# Altium schematic sheet ARDUINO_PINOUT.SchDoc
size A4
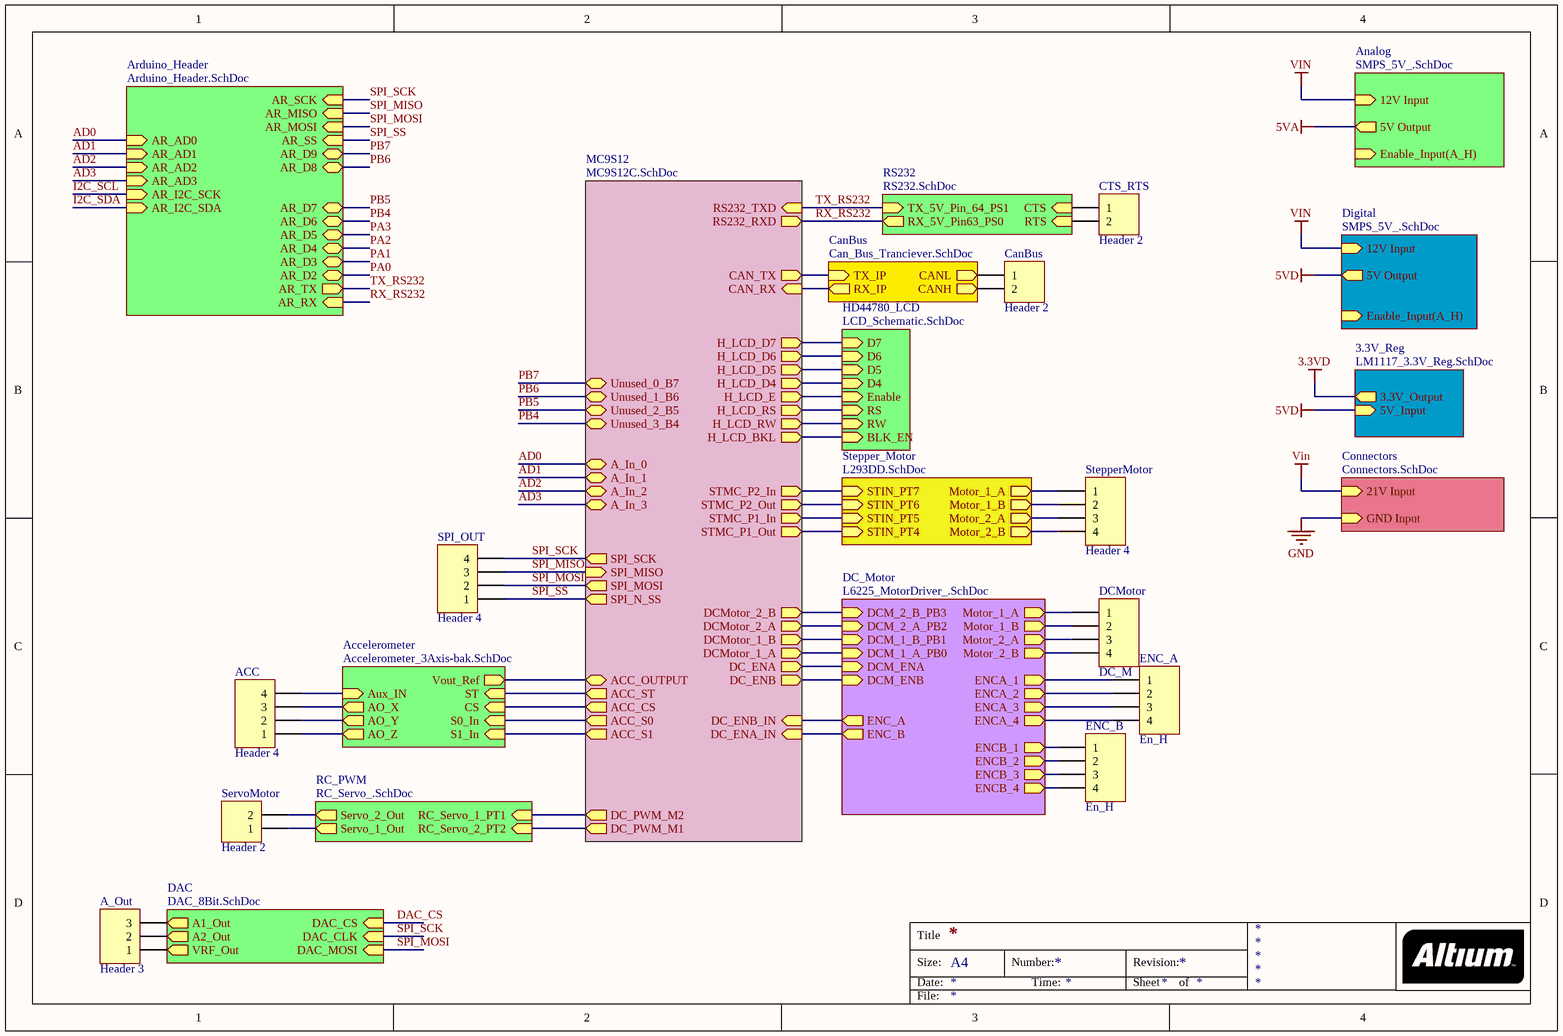
[diagram p0: ARDUINO_PINOUT.SchDoc]

## Parts
A_Out  Header 3  [HDR1X3]
ACC  Header 4  [HDR1X4]
CanBus  Header 2  [HDR1X2]
CTS_RTS  Header 2  [HDR1X2]
DCMotor  DC_M  [HDR1X4]
ENC_A  En_H  [HDR1X4]
ENC_B  En_H  [HDR1X4]
ServoMotor  Header 2  [HDR1X2]
SPI_OUT  Header 4  [HDR1X4]
StepperMotor  Header 4  [HDR1X4]

## Sub-sheets
3.3V_Reg = LM1117_3.3V_Reg.SchDoc: 3.3V_Output (out), 5V_Input (in)
Accelerometer = Accelerometer_3Axis-bak.SchDoc: AO_X (out), AO_Y (out), AO_Z (out), Aux_IN (in), S1_In (in), S0_In (in), Vout_Ref (out), ST (in), CS (in)
Analog = SMPS_5V_.SchDoc: 5V Output (out), 12V Input (in), Enable_Input(A_H) (in)
Arduino_Header = Arduino_Header.SchDoc: AR_RX (in), AR_TX (out), AR_AD0 (in), AR_AD1 (in), AR_AD2 (in), AR_AD3 (in), AR_I2C_SCK (in), AR_I2C_SDA (in), AR_D2, AR_D3, AR_D4, AR_D5, AR_D6, AR_D7, AR_D8, AR_D9, AR_MISO (in), AR_MOSI (in), AR_SCK (in), AR_SS (in)
CanBus = Can_Bus_Tranciever.SchDoc: TX_IP (in), CANH (out), CANL (out), RX_IP (out)
Connectors = Connectors.SchDoc: 21V Input (in), GND Input (in)
DAC = DAC_8Bit.SchDoc: A1_Out (out), A2_Out (out), VRF_Out (out), DAC_CS (in), DAC_CLK (in), DAC_MOSI (in)
DC_Motor = L6225_MotorDriver_.SchDoc: Motor_1_A (out), Motor_1_B (out), Motor_2_A (out), Motor_2_B (out), DCM_2_B_PB3 (in), DCM_2_A_PB2 (in), DCM_1_B_PB1 (in), DCM_1_A_PB0 (in), DCM_ENA (in), DCM_ENB (in), ENCA_1 (out), ENCA_2 (out), ENCA_3 (out), ENCA_4 (out), ENCB_1 (out), ENCB_2 (out), ENCB_3 (out), ENCB_4 (out), ENC_A (out), ENC_B (out)
Digital = SMPS_5V_.SchDoc: 5V Output (out), 12V Input (in), Enable_Input(A_H) (in)
HD44780_LCD = LCD_Schematic.SchDoc: D7 (in), D6 (in), D5 (in), D4 (in), Enable (in), RS (in), RW (in), BLK_EN (in)
MC9S12 = MC9S12C.SchDoc: RS232_TXD (in), RS232_RXD (out), H_LCD_D7 (out), H_LCD_D6 (out), H_LCD_D5 (out), H_LCD_D4 (out), H_LCD_RW (out), H_LCD_RS (out), H_LCD_E (out), CAN_TX (out), CAN_RX (in), DCMotor_2_B (out), DCMotor_2_A (out), DCMotor_1_B (out), DCMotor_1_A (out), DC_PWM_M1 (out), DC_PWM_M2 (out), STMC_P2_In (out), STMC_P2_Out (out), STMC_P1_In (out), STMC_P1_Out (out), DC_ENA (out), DC_ENB (out), H_LCD_BKL (out), SPI_SCK (out), SPI_MOSI (out), SPI_N_SS (out), SPI_MISO (in), DC_ENB_IN (in), DC_ENA_IN (in), ACC_OUTPUT (bidir), ACC_ST (out), ACC_CS (out), ACC_S0 (out), ACC_S1 (out), A_In_2 (bidir), A_In_0 (bidir), A_In_1 (bidir), A_In_3 (bidir), Unused_0_B7 (bidir), Unused_1_B6 (bidir), Unused_2_B5 (bidir), Unused_3_B4 (bidir)
RC_PWM = RC_Servo_.SchDoc: RC_Servo_2_PT2 (in), Servo_2_Out (out), Servo_1_Out (out), RC_Servo_1_PT1 (in)
RS232 = RS232.SchDoc: RTS (in), CTS (in), TX_5V_Pin_64_PS1 (in), RX_5V_Pin63_PS0 (out)
Stepper_Motor = L293DD.SchDoc: STIN_PT4 (in), STIN_PT5 (in), STIN_PT6 (in), STIN_PT7 (in), Motor_1_A (out), Motor_1_B (out), Motor_2_A (out), Motor_2_B (out)

## Nets
3.3VD: sheet 3.3V_Reg/3.3V_Output
5VA: sheet Analog/5V Output
5VD: sheet Digital/5V Output, sheet 3.3V_Reg/5V_Input
GND: sheet Connectors/GND Input
VIN: sheet Analog/12V Input, sheet Digital/12V Input, sheet Connectors/21V Input
AD0: sheet MC9S12/A_In_0, sheet Arduino_Header/AR_AD0
AD1: sheet MC9S12/A_In_1, sheet Arduino_Header/AR_AD1
AD2: sheet MC9S12/A_In_2, sheet Arduino_Header/AR_AD2
AD3: sheet MC9S12/A_In_3, sheet Arduino_Header/AR_AD3
DAC_CS: sheet DAC/DAC_CS
I2C_SCL: sheet Arduino_Header/AR_I2C_SCK
I2C_SDA: sheet Arduino_Header/AR_I2C_SDA
PA0: sheet Arduino_Header/AR_D2
PA1: sheet Arduino_Header/AR_D3
PA2: sheet Arduino_Header/AR_D4
PA3: sheet Arduino_Header/AR_D5
PB4: sheet MC9S12/Unused_3_B4, sheet Arduino_Header/AR_D6
PB5: sheet MC9S12/Unused_2_B5, sheet Arduino_Header/AR_D7
PB6: sheet MC9S12/Unused_1_B6, sheet Arduino_Header/AR_D8
PB7: sheet MC9S12/Unused_0_B7, sheet Arduino_Header/AR_D9
RX_RS232: sheet RS232/RX_5V_Pin63_PS0, sheet MC9S12/RS232_RXD, sheet Arduino_Header/AR_RX
SPI_MISO: SPI_OUT.3 ; sheet MC9S12/SPI_MISO, sheet Arduino_Header/AR_MISO
SPI_MOSI: SPI_OUT.2 ; sheet MC9S12/SPI_MOSI, sheet DAC/DAC_MOSI, sheet Arduino_Header/AR_MOSI
SPI_SCK: SPI_OUT.4 ; sheet MC9S12/SPI_SCK, sheet DAC/DAC_CLK, sheet Arduino_Header/AR_SCK
SPI_SS: SPI_OUT.1 ; sheet MC9S12/SPI_N_SS, sheet Arduino_Header/AR_SS
TX_RS232: sheet RS232/TX_5V_Pin_64_PS1, sheet MC9S12/RS232_TXD, sheet Arduino_Header/AR_TX
NetA_Out_1: A_Out.1 ; sheet DAC/VRF_Out
NetA_Out_2: A_Out.2 ; sheet DAC/A2_Out
NetA_Out_3: A_Out.3 ; sheet DAC/A1_Out
NetACC_1: ACC.1 ; sheet Accelerometer/AO_Z
NetACC_2: ACC.2 ; sheet Accelerometer/AO_Y
NetACC_3: ACC.3 ; sheet Accelerometer/AO_X
NetACC_4: ACC.4 ; sheet Accelerometer/Aux_IN
NetCanBus_1: CanBus.1 ; sheet CanBus/CANL
NetCanBus_2: CanBus.2 ; sheet CanBus/CANH
NetCTS_RTS_1: CTS_RTS.1 ; sheet RS232/CTS
NetCTS_RTS_2: CTS_RTS.2 ; sheet RS232/RTS
NetDCMotor_1: DCMotor.1 ; sheet DC_Motor/Motor_1_A
NetDCMotor_2: DCMotor.2 ; sheet DC_Motor/Motor_1_B
NetDCMotor_3: DCMotor.3 ; sheet DC_Motor/Motor_2_A
NetDCMotor_4: DCMotor.4 ; sheet DC_Motor/Motor_2_B
NetENC_A_1: ENC_A.1 ; sheet DC_Motor/ENCA_1
NetENC_A_2: ENC_A.2 ; sheet DC_Motor/ENCA_2
NetENC_A_3: ENC_A.3 ; sheet DC_Motor/ENCA_3
NetENC_A_4: ENC_A.4 ; sheet DC_Motor/ENCA_4
NetENC_B_1: ENC_B.1 ; sheet DC_Motor/ENCB_1
NetENC_B_2: ENC_B.2 ; sheet DC_Motor/ENCB_2
NetENC_B_3: ENC_B.3 ; sheet DC_Motor/ENCB_3
NetENC_B_4: ENC_B.4 ; sheet DC_Motor/ENCB_4
NetServoMotor_1: ServoMotor.1 ; sheet RC_PWM/Servo_1_Out
NetServoMotor_2: ServoMotor.2 ; sheet RC_PWM/Servo_2_Out
NetStepperMotor_1: StepperMotor.1 ; sheet Stepper_Motor/Motor_1_A
NetStepperMotor_2: StepperMotor.2 ; sheet Stepper_Motor/Motor_1_B
NetStepperMotor_3: StepperMotor.3 ; sheet Stepper_Motor/Motor_2_A
NetStepperMotor_4: StepperMotor.4 ; sheet Stepper_Motor/Motor_2_B
(unnamed): sheet MC9S12/H_LCD_D7, sheet HD44780_LCD/D7
(unnamed): sheet MC9S12/H_LCD_D6, sheet HD44780_LCD/D6
(unnamed): sheet MC9S12/H_LCD_D5, sheet HD44780_LCD/D5
(unnamed): sheet MC9S12/H_LCD_D4, sheet HD44780_LCD/D4
(unnamed): sheet MC9S12/H_LCD_RW, sheet HD44780_LCD/RW
(unnamed): sheet MC9S12/H_LCD_RS, sheet HD44780_LCD/RS
(unnamed): sheet MC9S12/H_LCD_E, sheet HD44780_LCD/Enable
(unnamed): sheet MC9S12/CAN_TX, sheet CanBus/TX_IP
(unnamed): sheet MC9S12/CAN_RX, sheet CanBus/RX_IP
(unnamed): sheet MC9S12/DCMotor_2_B, sheet DC_Motor/DCM_2_B_PB3
(unnamed): sheet MC9S12/DCMotor_2_A, sheet DC_Motor/DCM_2_A_PB2
(unnamed): sheet MC9S12/DCMotor_1_B, sheet DC_Motor/DCM_1_B_PB1
(unnamed): sheet MC9S12/DCMotor_1_A, sheet DC_Motor/DCM_1_A_PB0
(unnamed): sheet MC9S12/DC_PWM_M1, sheet RC_PWM/RC_Servo_2_PT2
(unnamed): sheet MC9S12/DC_PWM_M2, sheet RC_PWM/RC_Servo_1_PT1
(unnamed): sheet MC9S12/STMC_P2_In, sheet Stepper_Motor/STIN_PT7
(unnamed): sheet MC9S12/STMC_P2_Out, sheet Stepper_Motor/STIN_PT6
(unnamed): sheet MC9S12/STMC_P1_In, sheet Stepper_Motor/STIN_PT5
(unnamed): sheet MC9S12/STMC_P1_Out, sheet Stepper_Motor/STIN_PT4
(unnamed): sheet MC9S12/DC_ENA, sheet DC_Motor/DCM_ENA
(unnamed): sheet MC9S12/DC_ENB, sheet DC_Motor/DCM_ENB
(unnamed): sheet MC9S12/H_LCD_BKL, sheet HD44780_LCD/BLK_EN
(unnamed): sheet MC9S12/DC_ENB_IN, sheet DC_Motor/ENC_A
(unnamed): sheet MC9S12/DC_ENA_IN, sheet DC_Motor/ENC_B
(unnamed): sheet MC9S12/ACC_OUTPUT, sheet Accelerometer/Vout_Ref
(unnamed): sheet MC9S12/ACC_ST, sheet Accelerometer/ST
(unnamed): sheet MC9S12/ACC_CS, sheet Accelerometer/CS
(unnamed): sheet MC9S12/ACC_S0, sheet Accelerometer/S0_In
(unnamed): sheet MC9S12/ACC_S1, sheet Accelerometer/S1_In

## Notes on the sheet
- Title
- Size:
- Date:
- A4
- Number:
- Time:
- Revision:
- Sheet
- of
- File:

## Library data of the parts
A_Out = Header 3: Header, 3-Pin; LatestRevisionDate: 17-Jul-2002; LatestRevisionNote: Re-released for DXP Platform.; Publisher: Altium Limited
ACC DCMotor ENC_A ENC_B SPI_OUT StepperMotor = Header 4: Header, 4-Pin; LatestRevisionDate: 17-Jul-2002; LatestRevisionNote: Re-released for DXP Platform.; Publisher: Altium Limited
CanBus CTS_RTS ServoMotor = Header 2: Header, 2-Pin; PN: S1212E-02-ND; URL: http://www.digikey.ca/product-detail/en/PEC04SFAN/S1212E-02-ND